# EAGLE design M5_STACK_STAMP_C3_ISOBUS_DTF (EAGLE 9.6.2)
Assembly variants: Inline
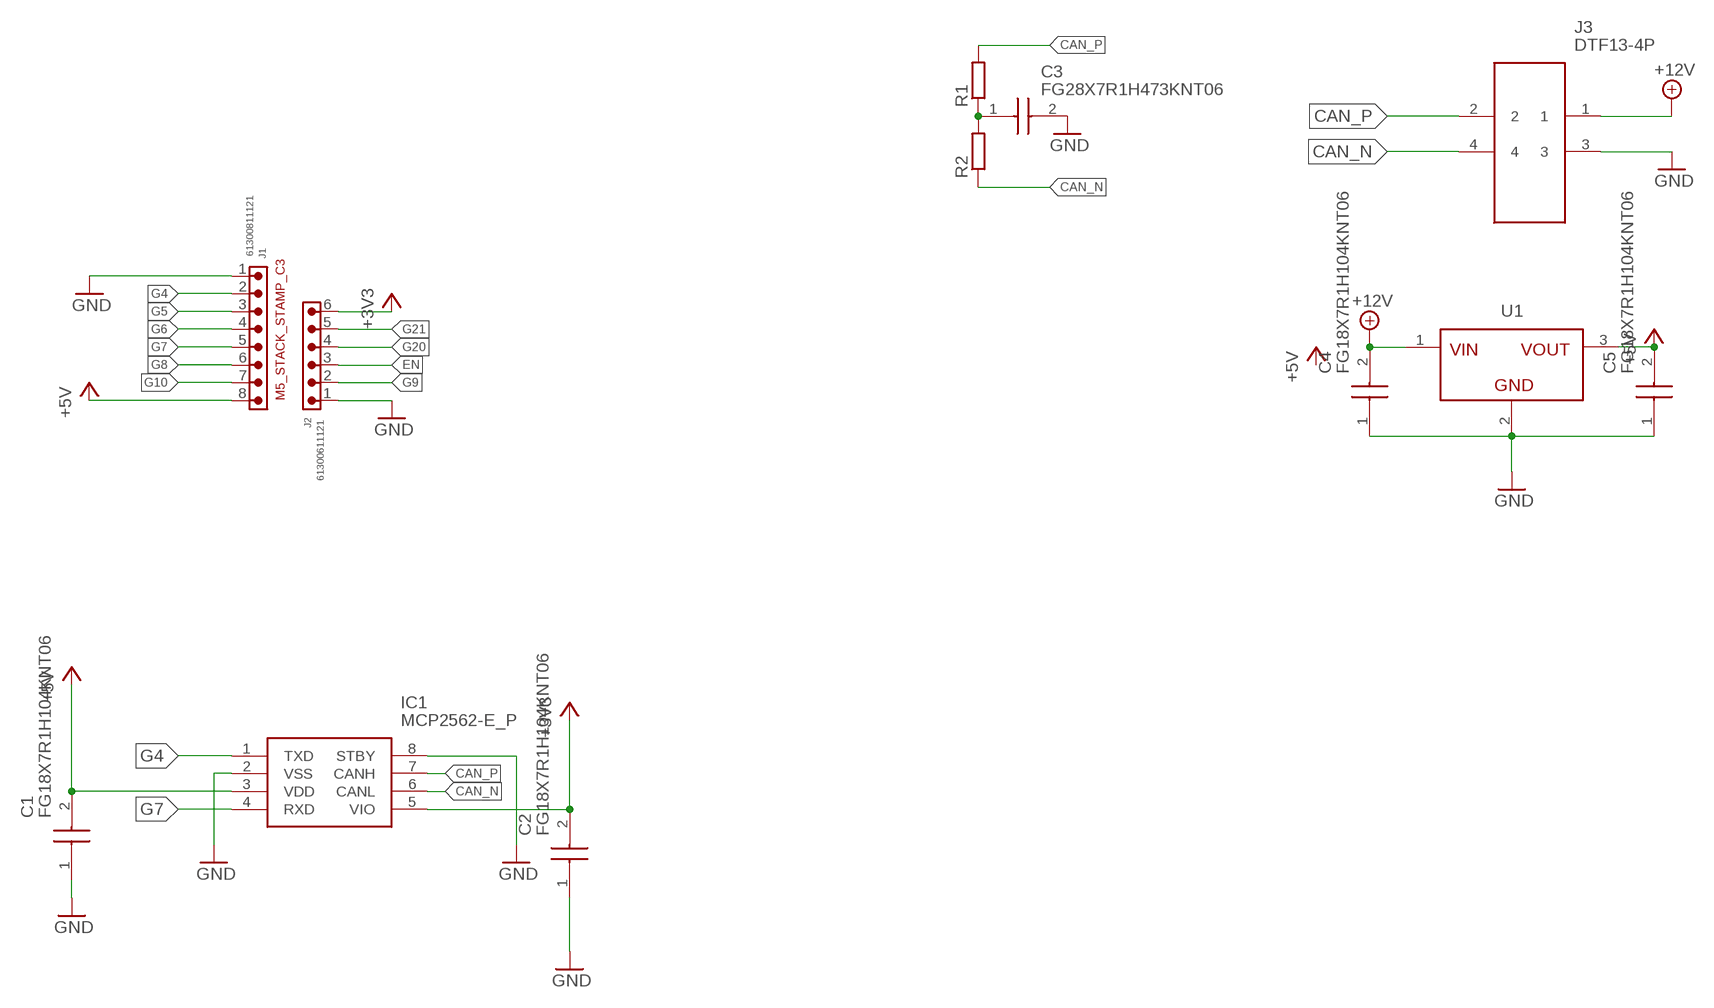
[diagram p0: schematic, sheet 1]

## Parts
C1  FG18X7R1H104KNT06  [FG18C0G1H101JNT06]
C2  FG18X7R1H104KNT06  [FG18C0G1H101JNT06]
C3  FG28X7R1H473KNT06  [FG28]
C4  FG18X7R1H104KNT06  [FG18C0G1H101JNT06]
C5  FG18X7R1H104KNT06  [FG18C0G1H101JNT06]
IC1  MCP2562-E_P  [DIP781W56P254L950H533Q8N]
J1  61300811121  6130XX11121_61300811121  [61300811121]
J2  61300611121  6130XX11121_61300611121  [61300611121]
J3  DTF13-4P  [DTF134P]
R1  R-EU_0204/7  [0204/7]
R2  R-EU_0204/7  [0204/7]
U1  MAGI³C-FDSM_SIP-3_173010542_173XXXX42  [MAGI³C-FDSM_173XXXX42]
U$1  M5_STACK_STAMP_C3  [M5_STACK_STAMP_C3]

## Nets
+3V3: C2.2 IC1.5(VIO) J2.6
+5V: C1.2 C5.2 IC1.3(VDD) J1.8 U1.3(VOUT)
+12V: C4.2 J3.1 U1.1(VIN)
CAN_N: IC1.6(CANL) J3.4 R2.1
CAN_P: IC1.7(CANH) J3.2 R1.2
EN: J2.3
G4: IC1.1(TXD) J1.2
G5: J1.3
G6: J1.4
G7: IC1.4(RXD) J1.5
G8: J1.6
G9: J2.2
G10: J1.7
G20: J2.4
G21: J2.5
GND: C1.1 C2.1 C3.2 C4.1 C5.1 IC1.2(VSS) IC1.8(STBY) J1.1 J2.1 J3.3 U1.2(GND)
N$1: C3.1 R1.1 R2.2

## Library data of the parts
C1 C2 C4 C5 = FG18X7R1H104KNT06-pcb-part-libraries:FG18X7R1H104KNT06: Multilayer Ceramic Capacitors MLCC - Leaded RAD 50V 0.1uF X7R 10% LS:2.5mm Source: Datasheet <https://product.tdk.com/en/system/files?file=dam/doc/product/capacitor/ceramic/lead-mlcc/catalog/leadmlcc_halogenfree_fg_en.pdf>; DESCRIPTION: Multilayer Ceramic Capacitors MLCC - Leaded RAD 50V 0.1uF X7R 10% LS:2.5mm; HEIGHT: 5.5mm; MANUFACTURER_NAME: TDK; MANUFACTURER_PART_NUMBER: FG18X7R1H104KNT06; MOUSER_PART_NUMBER: 810-FG18X7R1H104KNT6; MOUSER_PRICE-STOCK: https://www.mouser.co.uk/ProductDetail/TDK/FG18X7R1H104KNT06?qs=qf2ddTMq67WA8sH6FratLA%3D%3D
C3 = FG28X7R1H473KNT06-pcb-part-libraries:FG28X7R1H473KNT06: MLCC with dipped radial lead Source: Datasheet <https://componentsearchengine.com/Datasheets/1/FG28X7R1H473KNT06.pdf>; DESCRIPTION: MLCC with dipped radial lead; HEIGHT: 5.5mm; MANUFACTURER_NAME: TDK; MANUFACTURER_PART_NUMBER: FG28X7R1H473KNT06; MOUSER_PART_NUMBER: 810-FG28X7R1H473KNT6; MOUSER_PRICE-STOCK: https://www.mouser.com/Search/Refine.aspx?Keyword=810-FG28X7R1H473KNT6
IC1 = MCP2562-E_P-pcb-part-libraries:MCP2562-E_P: CAN Transceiver 1Mbps 5V 125degC PDIP8 Microchip MCP2562-E/P, CAN Transceiver 1-channel IEC 61000-4-2, 8-Pin PDIP Source: Datasheet <https://datasheet.datasheetarchive.com/originals/distributors/Datasheets-DGA14/1194231.pdf>; DESCRIPTION: CAN Transceiver 1Mbps 5V 125degC PDIP8 Microchip MCP2562-E/P, CAN Transceiver 1-channel IEC 61000-4-2, 8-Pin PDIP; HEIGHT: 5.334mm; MANUFACTURER_NAME: Microchip; MANUFACTURER_PART_NUMBER: MCP2562-E/P; MOUSER_PART_NUMBER: 579-MCP2562-E/P; MOUSER_PRICE-STOCK: https://www.mouser.co.uk/ProductDetail/Microchip-Technology/MCP2562-E-P?qs=6qKXPk0vzx1U%252B0h82Z%2Fybg%3D%3D
J1 = Wurth_Connectors_WR-PHD:6130XX11121_61300811121: WR-PHD 2.54 mm THT Pin Header ARTICLE PROPERTIES: Pins:1;​ 2;​ 3;​ 4;​ 5;​ 6;​ 7;​ 8;​ 9;​ 10;​ 12;​ 13;​ 14;​ 15;​ 16;​ 18;​ 20;​ 22;​ 24;​ 25;​ 32;​ 36;​ 40 KIND PROPERTIES: Pitch：2.54 mm Quality Class:3 as per CECC 75 301-802 Rows：Single Gender：Pin Header Type：Straight MATERIAL PROPERTIES: Insulator Material :PBT Insulator Flammability Rating:UL94 V-0 Contact Material:Copper Alloy Contact Plating:Gold Contact Type:Stamped GENERAL INFORMATION Operating Temperature:-40 up to +105 °C Compliance:RoHS ELECTRICAL PROPERTIES: Rated Current:3 A IR 1:3 A Withstanding Voltage:500 V (AC) Contact Resistance:20 mΩ RISO:1000 MΩ CERTIFICATION UL Approval:E323964 PACKAGING PROPERTIES Packaging:Bag <https://katalog.we-online.com/media/images/v2/o33211v209%20Family_BTB_PHD_6130xx11121.jpg> Details see: https://katalog.we-online.com/en/em/PHD_2_54_THT_PIN_HEADER_6130XX11121 Updated by Yingchun,Shan 2019-10-16 2019 (C) Würth Elektronik; DATASHEET-URL: https://www.we-online.com/catalog/datasheet/61300811121.pdf; GENDER: Pin Header; IR: 3A; MOUNT: THT; PACKAGING: Bag; PART-NUMBER: 61300811121; PINS: 8; PITCH: 2.54mm; ROWS: Single; TYPE: Straight
J2 = Wurth_Connectors_WR-PHD:6130XX11121_61300611121: WR-PHD 2.54 mm THT Pin Header ARTICLE PROPERTIES: Pins:1;​ 2;​ 3;​ 4;​ 5;​ 6;​ 7;​ 8;​ 9;​ 10;​ 12;​ 13;​ 14;​ 15;​ 16;​ 18;​ 20;​ 22;​ 24;​ 25;​ 32;​ 36;​ 40 KIND PROPERTIES: Pitch：2.54 mm Quality Class:3 as per CECC 75 301-802 Rows：Single Gender：Pin Header Type：Straight MATERIAL PROPERTIES: Insulator Material :PBT Insulator Flammability Rating:UL94 V-0 Contact Material:Copper Alloy Contact Plating:Gold Contact Type:Stamped GENERAL INFORMATION Operating Temperature:-40 up to +105 °C Compliance:RoHS ELECTRICAL PROPERTIES: Rated Current:3 A IR 1:3 A Withstanding Voltage:500 V (AC) Contact Resistance:20 mΩ RISO:1000 MΩ CERTIFICATION UL Approval:E323964 PACKAGING PROPERTIES Packaging:Bag <https://katalog.we-online.com/media/images/v2/o33211v209%20Family_BTB_PHD_6130xx11121.jpg> Details see: https://katalog.we-online.com/en/em/PHD_2_54_THT_PIN_HEADER_6130XX11121 Updated by Yingchun,Shan 2019-10-16 2019 (C) Würth Elektronik; DATASHEET-URL: https://www.we-online.com/catalog/datasheet/61300611121.pdf; GENDER: Pin Header; IR: 3A; MOUNT: THT; PACKAGING: Bag; PART-NUMBER: 61300611121; PINS: 6; PITCH: 2.54mm; ROWS: Single; TYPE: Straight
J3 = DTF13-4P-pcb-part-libraries:DTF13-4P: Automotive Connectors 4P DTF RECP ASM 90 DEG. HEADER Source: Datasheet <https://www.te.com/commerce/DocumentDelivery/DDEController?Action=showdoc&DocId=Customer DrawingDTF13-4PApdfEnglishENG_CD_DTF13-4P_A.pdfDTF13-4P>; DESCRIPTION: Automotive Connectors 4P DTF RECP ASM 90 DEG. HEADER; HEIGHT: 20.22mm; MANUFACTURER_NAME: TE Connectivity; MANUFACTURER_PART_NUMBER: DTF13-4P; MOUSER_PART_NUMBER: 571-DTF13-4P; MOUSER_PRICE-STOCK: https://www.mouser.co.uk/ProductDetail/TE-Connectivity-DEUTSCH/DTF13-4P?qs=vkMqrgFpRaj6YYUKpv5OLg%3D%3D
R1 R2 = resistor:R-EU_: RESISTOR, European symbol
U1 = Wurth_Step Down Converter_MagI³C-FDSM:MAGI³C-FDSM_SIP-3: MagI³C-FDSM Fixed Step Down Regulator Module Characteristics Simplest design (no power supply knowledge required) Leaded through-hole package for easy manufacturing and prototyping Stand alone solution (CIN and COUT integrated, no external components) L78x series linear regulator replacement (no heatsink required) Low conducted and radiated EMI (compliant to EN55022 class B) Applications Point-of-Load from 24V, 18V, 15V, 12V, 9V rail Replacement for linear regulators Interface and microcontroller supply Industrial, Test & Measurement, Medical applications System power supplies <https://katalog.we-online.com/media/images/v2/o55808v209%20FDSM_MagI3C_173010378_4C.jpg> Details see: https://www.we-online.de/katalog/en/MAGIC_FDSM_FIXED_OUTPUT_VOLTAGE/ Updated by Ella Wu 2020-03-17 2020 (C) Würth Elektronik; DATASHEET-URL: https://www.we-online.de/katalog/datasheet/173010542.pdf; I-OUTPUT: 1A; MOUNT: THT; PART-NUMBER: 173010542; V-INPUT: 8-42V; V-OUTPUT: 5V
U$1 = M5_STACK_STAMP_C3:M5_STACK_STAMP_C3

## Board
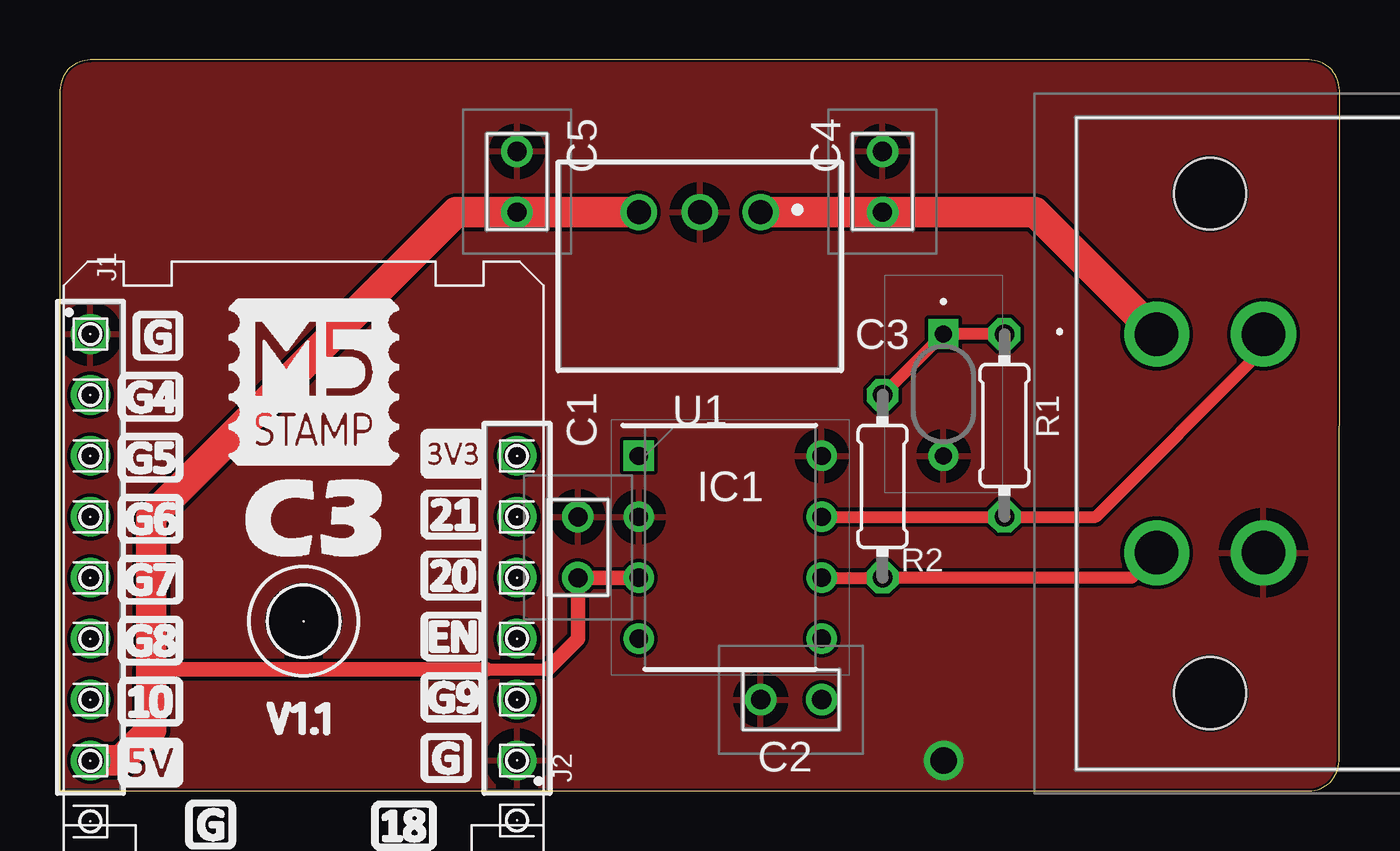
[diagram p1: board, top side]
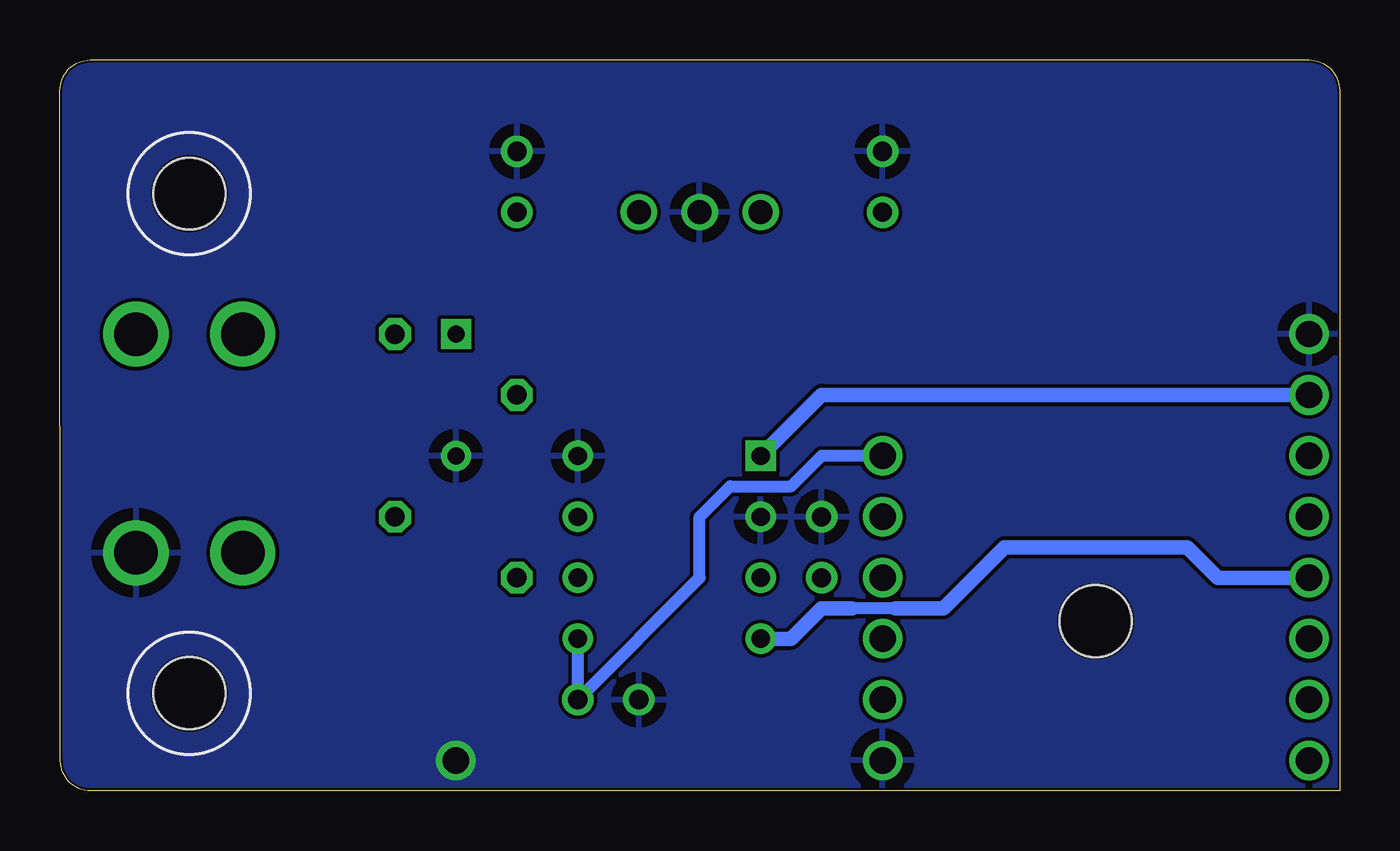
[diagram p2: board, bottom side, seen from below]

Size 53.34 x 30.48 mm. Coordinates in mm from the lower left corner, seen from the top.
Outline: 0,0 52.05,0 arc90 53.32,1.27 53.34,29.21 arc90 52.07,30.48 1.27,30.48 arc90 0,29.21 0,0
Copper layers (1*16): Top 0.035mm / dielectric 1.5mm / Bottom 0.035mm
Design rules "default *": minimum track width 6mil, minimum drill 0.35mm, track to track 6mil, track to pad 6mil, pad to pad 6mil, via to via 6mil, smd to smd 6mil, copper to edge 4mil, drill to drill 6mil, minimum pad ring 10mil, minimum via ring 8mil, stop-mask expansion 4mil, vias tented up to drill 0mil, thermal gap 20mil

### Footprints (pad centres in the part's own frame; a part is rotated, then mirrored left to right if it is on the bottom)
FG18C0G1H101JNT06 = drill 0.8 pad 1.3: 1 -1.27,0; 2 1.27,0
FG28 = drill 0.7 pad 1.25 square: 1 0,0 | drill 0.7 pad 1.25: 2 5.08,0
DIP781W56P254L950H533Q8N = drill 0.759 pad 1.159 square: 1 -3.81,3.81 | drill 0.759 pad 1.159: 2 -3.81,1.27; 3 -3.81,-1.27; 4 -3.81,-3.81; 5 3.81,-3.81; 6 3.81,-1.27; 7 3.81,1.27; 8 3.81,3.81
61300811121 = drill 1.1: 1 -8.89,0; 2 -6.35,0; 3 -3.81,0; 4 -1.27,0; 5 1.27,0; 6 3.81,0; 7 6.35,0; 8 8.89,0
61300611121 = drill 1.1: 1 -6.35,0; 2 -3.81,0; 3 -1.27,0; 4 1.27,0; 5 3.81,0; 6 6.35,0
DTF134P = drill 1.81 pad 2.715: 1 0,0; 2 -4.45,0; 3 -4.45,9.12; 4 0,9.12 | hole 3: -2.225,14.975; -2.225,-5.855
0204/7 = drill 0.813 octagon: 1 -3.81,0; 2 3.81,0
MAGI³C-FDSM_173XXXX42 = drill 1: 1 -2.54,0; 2 0,0; 3 2.54,0
M5_STACK_STAMP_C3 = hole 3: 8.89,-11.97

### Placement (x,y rotation side)
C1  21.59,10.16 270 top
C2  30.48,3.81 0 top
C3  36.83,19.05 270 top
C4  34.29,25.4 270 top
C5  19.05,25.4 270 top
IC1  27.94,10.16 0 top
J1  1.27,10.16 270 top
J2  19.05,7.62 90 top
J3  45.72,19.05 180 top
R1  39.37,15.24 270 top
R2  34.29,12.7 90 top
U1  26.67,24.13 180 top
U$1  1.27,19.05 0 top

### Tracks (layer width: path | path; a pad name or v marks a point on that pad's centre or on a via)
+3V3
  Bottom 0.508: J2.6 21.59,13.97 22.86,12.7 25.4,12.7 26.67,11.43 26.67,8.89 C2.2 IC1.5
+5V
  Top 0.508: 17.78,5.08 20.32,5.08
  Top 0.61: IC1.3 C1.2 21.59,6.35 20.32,5.08 | 3.81,5.08 17.78,5.08
  Top 1.27: U1.3 C5.2 16.51,24.13 3.81,11.43 3.81,5.08 3.81,2.54 2.54,1.27 J1.8
+12V
  Top 1.27: U1.1 C4.2 40.64,24.13 J3.1
CAN_N
  Top 0.508: IC1.6 R2.1 44.68,8.89 J3.4
CAN_P
  Top 0.508: IC1.7 R1.2 43.18,11.43 50.17,18.42 J3.2
G4
  Bottom 0.61: IC1.1 21.59,16.51 J1.2
G7
  Bottom 0.508: 18.51,7.62 20.32,7.62
  Bottom 0.61: J1.5 5.08,8.89 6.35,10.16 13.97,10.16 16.51,7.62 18.51,7.62 | IC1.4 22.86,6.35 21.59,7.62 20.32,7.62
GND  (via drill 1.1)
  other vias: 36.83,1.27
  pour Top: -1.27,31.75 54.61,31.75 54.61,-3.81 -1.27,-3.81
  pour Bottom: -1.27,31.75 54.61,31.75 54.61,-3.81 -1.27,-3.81
N$1
  Top 0.508: R1.1 C3.1 R2.2